# EAGLE design dual-h-v1 (EAGLE 9.2.2)
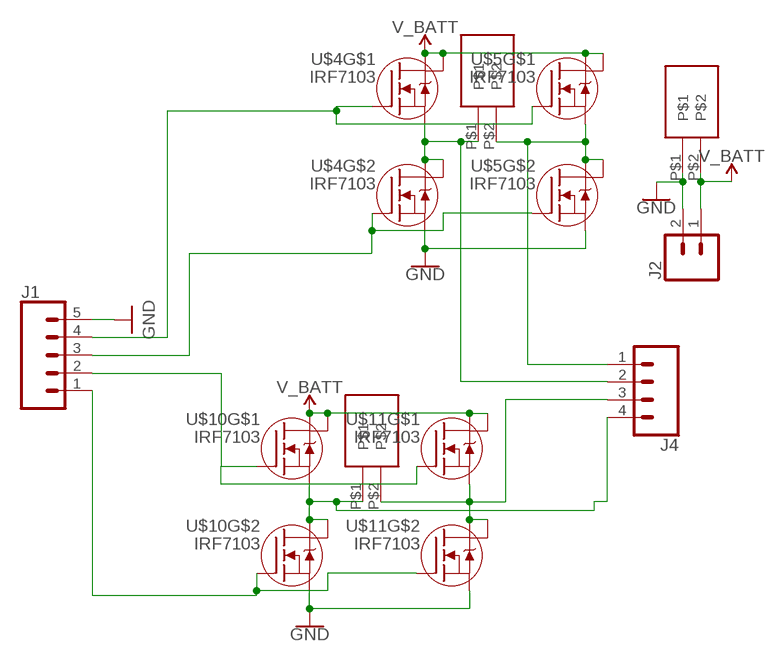
[diagram p0: schematic, sheet 1]

## Parts
J1  CONN_05  [1X05]
J2  CONN_02  [1X02]
J4  CONN_04  [1X04]
U$1  SPRING-TERMINAL  [SPRING-TERMINAL]
U$4  IRF7103  [SO8-2]
U$5  IRF7103  [SO8-2]
U$6  SPRING-TERMINAL  [SPRING-TERMINAL]
U$10  IRF7103  [SO8-2]
U$11  IRF7103  [SO8-2]
U$12  SPRING-TERMINAL  [SPRING-TERMINAL]

## Nets
GND: J1.5 J2.2 U$1.P$1 U$4.3(S) U$5.3(S) U$10.3(S) U$11.3(S)
N$2: J4.4 U$10.1(S) U$10.5(D) U$10.6(D) U$12.P$1
N$22: J4.2 U$4.1(S) U$4.5(D) U$4.6(D) U$6.P$1
N$26: J4.1 U$5.1(S) U$5.5(D) U$5.6(D) U$6.P$2
N$34: J1.4 U$4.2(G) U$5.2(G)
N$35: J1.1 U$10.4(G) U$11.4(G)
N$36: J1.3 U$4.4(G) U$5.4(G)
N$40: J4.3 U$11.1(S) U$11.5(D) U$11.6(D) U$12.P$2
N$46: J1.2 U$10.2(G) U$11.2(G)
V_BATT: J2.1 U$1.P$2 U$4.7(D) U$4.8(D) U$5.7(D) U$5.8(D) U$10.7(D) U$10.8(D) U$11.7(D) U$11.8(D)

## Library data of the parts
J1 = SparkFun-Connectors:CONN_05: Multi connection point. Often used as Generic Header-pin footprint for 0.1 inch spaced/style header connections On any of the 0.1 inch spaced packages, you can populate with these: Break Away Headers - Straight <https://www.sparkfun.com/products/116> (PRT-00116) Break Away Male Headers - Right Angle <https://www.sparkfun.com/products/553> (PRT-00553) Female Headers <https://www.sparkfun.com/products/115> (PRT-00115) Break Away Headers - Machine Pin <https://www.sparkfun.com/products/117> (PRT-00117) Break Away Female Headers - Swiss Machine Pin <https://www.sparkfun.com/products/743> (PRT-00743) For SCREWTERMINALS and SPRING TERMINALS visit here: Screw Terimnals on SparkFun.com <https://www.sparkfun.com/search/results?term=Screw+Terminals> (5mm/3.5mm/2.54mm spacing) This device is also useful as a general connection point to wire up your design to another part of your project. Our various solder wires solder well into these plated through hole pads. Hook-Up Wire - Assortment (Stranded, 22 AWG) <https://www.sparkfun.com/products/11375> (PRT-11375) Hook-Up Wire - Assortment (Solid Core, 22 AWG) <https://www.sparkfun.com/products/11367> (PRT-11367) View the entire wire category on our website here <https://www.sparkfun.com/categories/141> Special notes: Molex polarized connector foot print use with SKU : PRT-08231 with associated crimp pins and housings. 1MM SMD Version SKU: PRT-10208
J2 = SparkFun-Connectors:CONN_02: Multi connection point. Often used as Generic Header-pin footprint for 0.1 inch spaced/style header connections On any of the 0.1 inch spaced packages, you can populate with these: Break Away Headers - Straight <https://www.sparkfun.com/products/116> (PRT-00116) Break Away Male Headers - Right Angle <https://www.sparkfun.com/products/553> (PRT-00553) Female Headers <https://www.sparkfun.com/products/115> (PRT-00115) Break Away Headers - Machine Pin <https://www.sparkfun.com/products/117> (PRT-00117) Break Away Female Headers - Swiss Machine Pin <https://www.sparkfun.com/products/743> (PRT-00743) For SCREWTERMINALS and SPRING TERMINALS visit here: Screw Terimnals on SparkFun.com <https://www.sparkfun.com/search/results?term=Screw+Terminals> (5mm/3.5mm/2.54mm spacing) This device is also useful as a general connection point to wire up your design to another part of your project. Our various solder wires solder well into these plated through hole pads. Hook-Up Wire - Assortment (Stranded, 22 AWG) <https://www.sparkfun.com/products/11375> (PRT-11375) Hook-Up Wire - Assortment (Solid Core, 22 AWG) <https://www.sparkfun.com/products/11367> (PRT-11367) View the entire wire category on our website here <https://www.sparkfun.com/categories/141> Special notes: Molex polarized connector foot print use with: PRT-08233 with associated crimp pins and housings. 2.54_SCREWTERM for use with PRT-10571. 3.5mm Screw Terminal footprints for PRT-08084 5mm Screw Terminal footprints for use with PRT-08432
J4 = SparkFun-Connectors:CONN_04: Multi connection point. Often used as Generic Header-pin footprint for 0.1 inch spaced/style header connections On any of the 0.1 inch spaced packages, you can populate with these: Break Away Headers - Straight <https://www.sparkfun.com/products/116> (PRT-00116) Break Away Male Headers - Right Angle <https://www.sparkfun.com/products/553> (PRT-00553) Female Headers <https://www.sparkfun.com/products/115> (PRT-00115) Break Away Headers - Machine Pin <https://www.sparkfun.com/products/117> (PRT-00117) Break Away Female Headers - Swiss Machine Pin <https://www.sparkfun.com/products/743> (PRT-00743) For SCREWTERMINALS and SPRING TERMINALS visit here: Screw Terimnals on SparkFun.com <https://www.sparkfun.com/search/results?term=Screw+Terminals> (5mm/3.5mm/2.54mm spacing) This device is also useful as a general connection point to wire up your design to another part of your project. Our various solder wires solder well into these plated through hole pads. Hook-Up Wire - Assortment (Stranded, 22 AWG) <https://www.sparkfun.com/products/11375> (PRT-11375) Hook-Up Wire - Assortment (Solid Core, 22 AWG) <https://www.sparkfun.com/products/11367> (PRT-11367) View the entire wire category on our website here <https://www.sparkfun.com/categories/141> Special notes: Molex polarized connector foot print use with SKU : PRT-08231 with associated crimp pins and housings. 1MM SMD Version SKU: PRT-10208; PROD_ID: CONN-09696
U$1 U$6 U$12 = spietz-library-2:SPRING-TERMINAL
U$4 U$5 U$10 U$11 = irf-7103:IRF7103: HEXFET® Power MOSFET Adavanced Process Technology Ultra Low On-Resistance Dual N-Channel MOSFET Surface Mount Available in Tape & Reel Dynamic dv/dt Rating Fast Switching Please connect both Drain-Pins of each FET for thermal Reasons! (Pin 5 with Pin 6, 7 with 8)

## Board
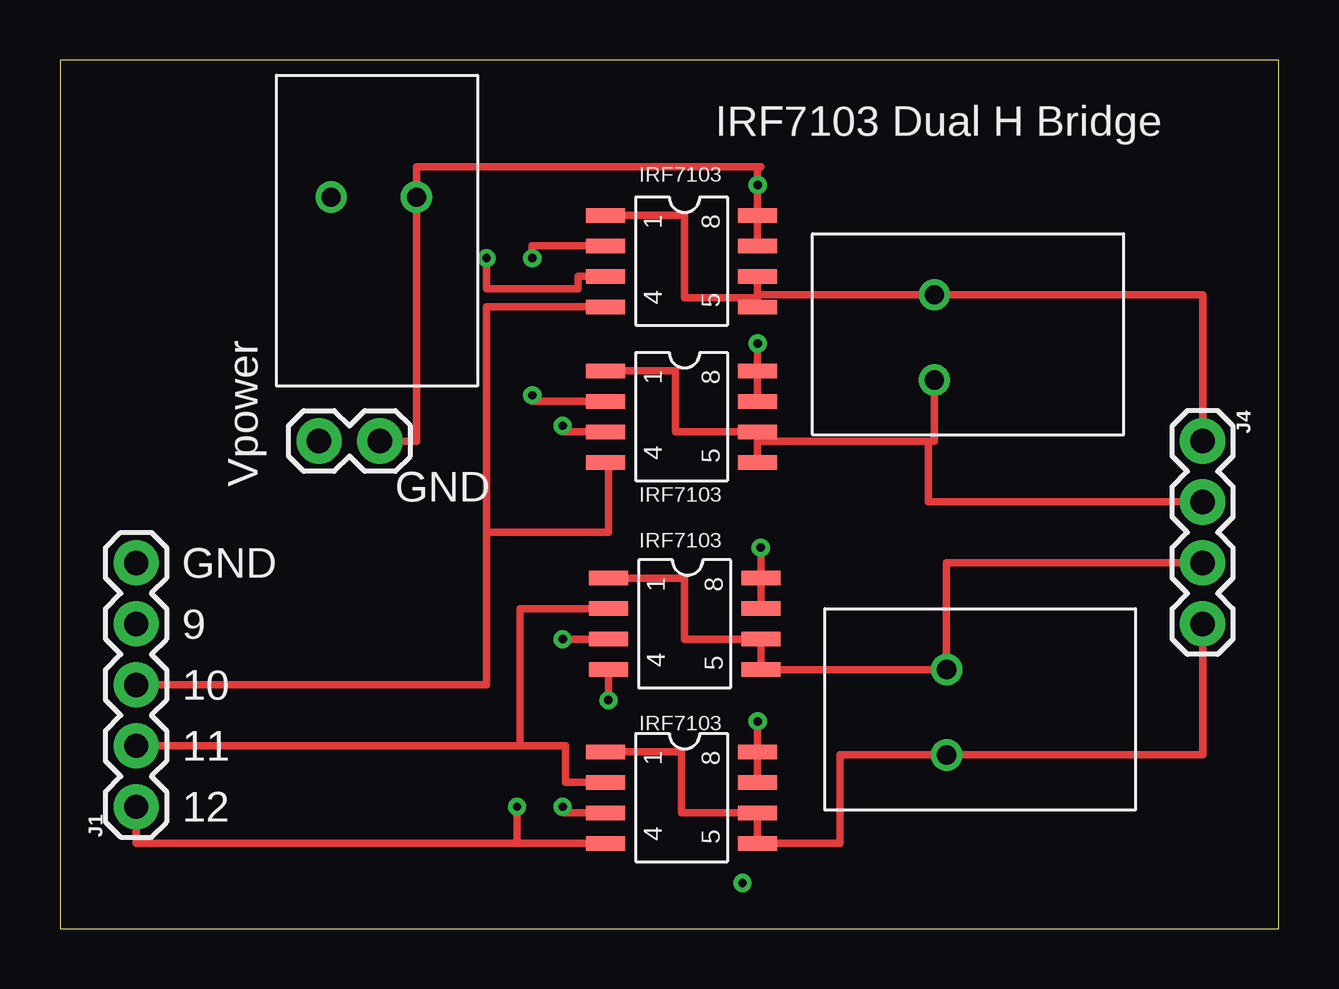
[diagram p1: board, top side]
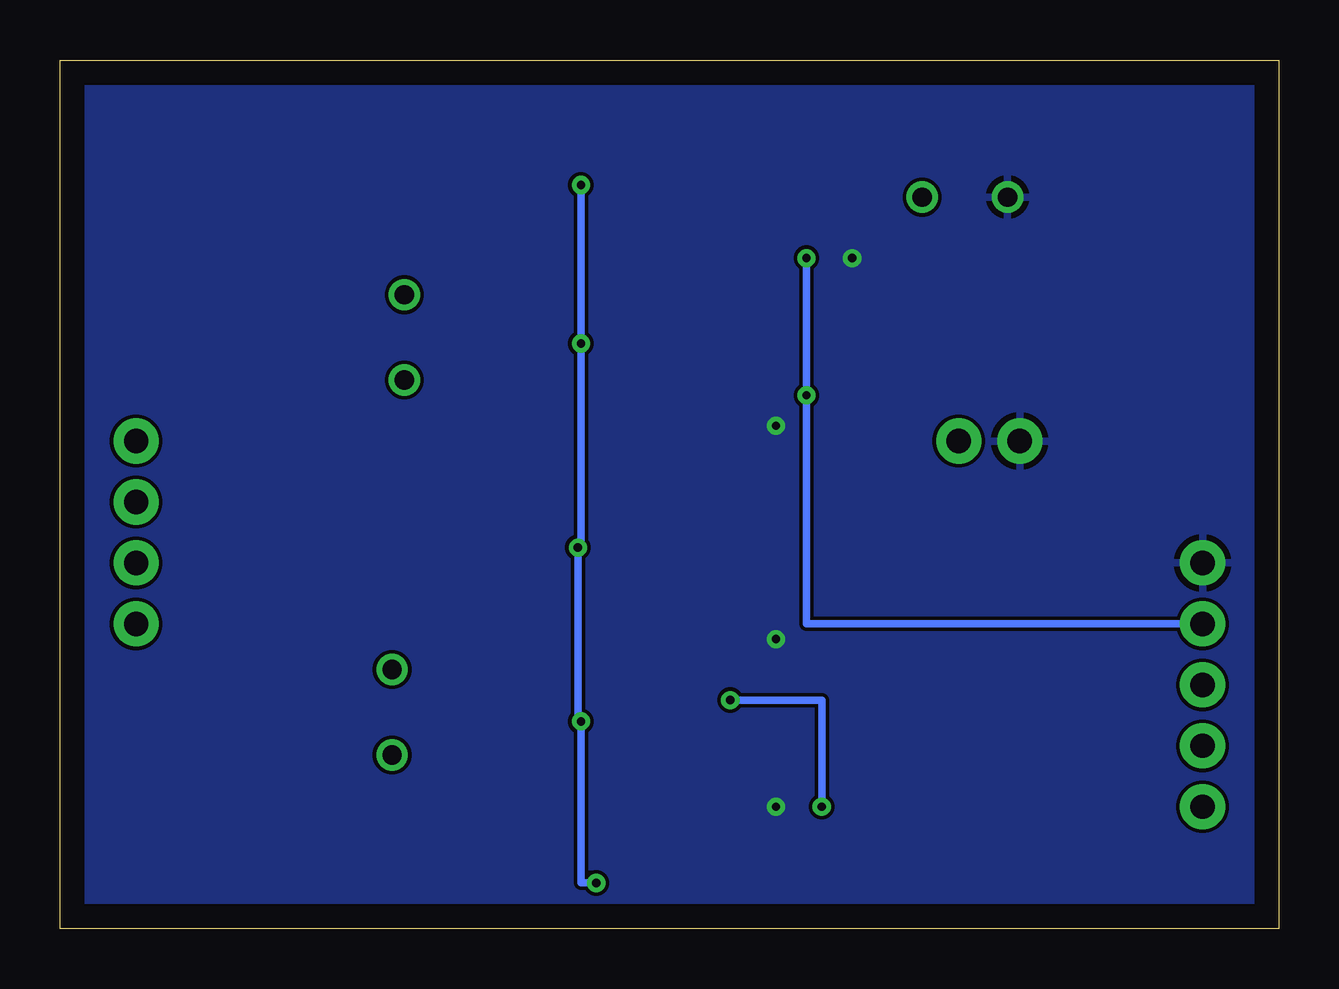
[diagram p2: board, bottom side, seen from below]

Size 50.8 x 36.2 mm. Coordinates in mm from the lower left corner, seen from the top.
Outline: 0,0 50.8,0 50.8,36.2 0,36.2 0,0
Copper layers (1*16): Top 0.035mm / dielectric 1.5mm / Bottom 0.035mm
Design rules "default": minimum track width 6mil, minimum drill 0.35mm, track to track 6mil, track to pad 6mil, pad to pad 6mil, via to via 6mil, smd to smd 6mil, copper to edge 40mil, drill to drill 6mil, minimum pad ring 10mil, minimum via ring 8mil, stop-mask expansion 4mil, vias tented up to drill 0mil, thermal gap 10mil

### Footprints (pad centres in the part's own frame; a part is rotated, then mirrored left to right if it is on the bottom)
1X05 = drill 1.016 pad 1.88: 1 0,0; 2 2.54,0; 3 5.08,0; 4 7.62,0; 5 10.16,0
1X02 = drill 1.016 pad 1.88: 1 0,0; 2 2.54,0
1X04 = drill 1.016 pad 1.88: 1 0,0; 2 2.54,0; 3 5.08,0; 4 7.62,0
SPRING-TERMINAL = drill 0.8: P$1 5.08,1.778; P$2 5.08,5.334
SO8-2 = smd 0.61 x 1.626: 1 -2.54,-2.54; 2 -1.27,-2.54; 3 0,-2.54; 4 1.27,-2.54; 5 1.27,3.81; 6 0,3.81; 7 -1.27,3.81; 8 -2.54,3.81

### Placement (x,y rotation side)
J1  3.17,5.08 90 top
J2  13.34,20.32 180 top
J4  47.62,20.32 270 top
U$1  9.53,35.56 270 top
U$4  25.27,20.7 270 top
U$5  25.27,27.18 270 top
U$6  31.37,21.08 0 top
U$10  25.27,4.83 270 top
U$11  25.4,12.06 270 top
U$12  31.88,5.46 0 top

### Tracks (layer width: path | path; a pad name or v marks a point on that pad's centre or on a via)
GND  (via drill 0.35)
  Top 0.305: U$10.3 20.95,4.83 v20.95,5.08 | U$11.3 v20.95,12.06 | U$5.3 21.59,27.18 21.59,26.67 17.78,26.67 v17.78,27.94 | U$4.3 20.95,20.7 v20.95,20.95
  pour Bottom: 0,0 50.8,0 50.8,36.2 0,36.2
N$2
  Top 0.305: U$10.1 25.91,7.37 25.91,4.83 U$10.6 U$10.5 32.51,3.56 32.51,7.24 U$12.P$1 47.62,7.24 J4.4
N$22
  Top 0.305: U$4.5 29.08,20.32 | 29.08,20.32 U$4.6 25.65,20.7 25.65,23.24 U$4.1 | U$6.P$1 36.45,20.32 36.2,20.32 | 36.2,20.32 29.08,20.32 | J4.2 36.2,17.78 36.2,20.32
N$26
  Top 0.305: U$5.5 29.08,26.29 | 29.08,26.29 29.08,26.42 | 29.08,26.42 U$5.6 | 29.08,26.42 U$6.P$2 47.62,26.42 J4.1 | 29.08,26.29 26.04,26.29 26.04,29.72 U$5.1
N$34  (via drill 0.35)
  Top 0.305: v19.68,22.23 19.68,21.97 U$4.2 | U$5.2 19.68,28.45 v19.68,27.94
  Bottom 0.305: J1.4 19.68,12.7 v19.68,22.23 v19.68,27.94
N$35  (via drill 0.35)
  Top 0.305: J1.1 3.17,3.56 19.05,3.56 | U$10.4 20.32,3.56 19.05,3.56 | 19.05,3.56 v19.05,5.08 | v22.86,9.53 U$11.4
  Bottom 0.305: v19.05,5.08 19.05,9.53 v22.86,9.53
N$36
  Top 0.305: J1.3 17.78,10.16 17.78,16.51 | 17.78,16.51 22.86,16.51 22.86,19.43 U$4.4 | 17.78,16.51 17.78,25.91 U$5.4
N$40
  Top 0.305: U$11.1 26.04,14.61 26.04,12.06 U$11.6 U$11.5 U$12.P$2 36.96,15.24 J4.3
N$46
  Top 0.305: U$10.2 21.08,6.1 21.08,7.62 19.18,7.62 | U$11.2 19.18,13.34 19.18,7.62 | J1.2 19.18,7.62
V_BATT  (via drill 0.35)
  Top 0.305: U$5.7 U$5.8 v29.08,30.99 29.08,31.75 | U$11.7 U$11.8 v29.21,15.88 | U$4.7 U$4.8 v29.08,24.38 | U$10.7 U$10.8 v29.08,8.64 | J2.1 14.86,20.32 U$1.P$2 14.86,31.75 29.08,31.75 | 29.21,31.75 29.08,31.75
  Bottom 0.305: 29.21,30.99 v29.08,30.99 v29.08,24.38 29.08,15.88 v29.21,15.88 29.21,8.64 v29.08,8.64 29.08,1.91 v28.45,1.91

### Text on the board
tPlace: IRF7103 Dual H Bridge | IRF7103 | Vpower | GND | IRF7103 | IRF7103 | GND | 9 | 10 | IRF7103 | 11 | 12